# EasyEDA Pro project usbc_hub_schematic.epro

# Schematic Schematic2
Board Name: PCB2; Create Date: 2025-07-27; Page Name: P1; Project Name: usbchub; Schematic Name: Schematic2; Update Date: 2025-07-29; Company: EasyEDA.com; Page Size: A4; Version: V1.0
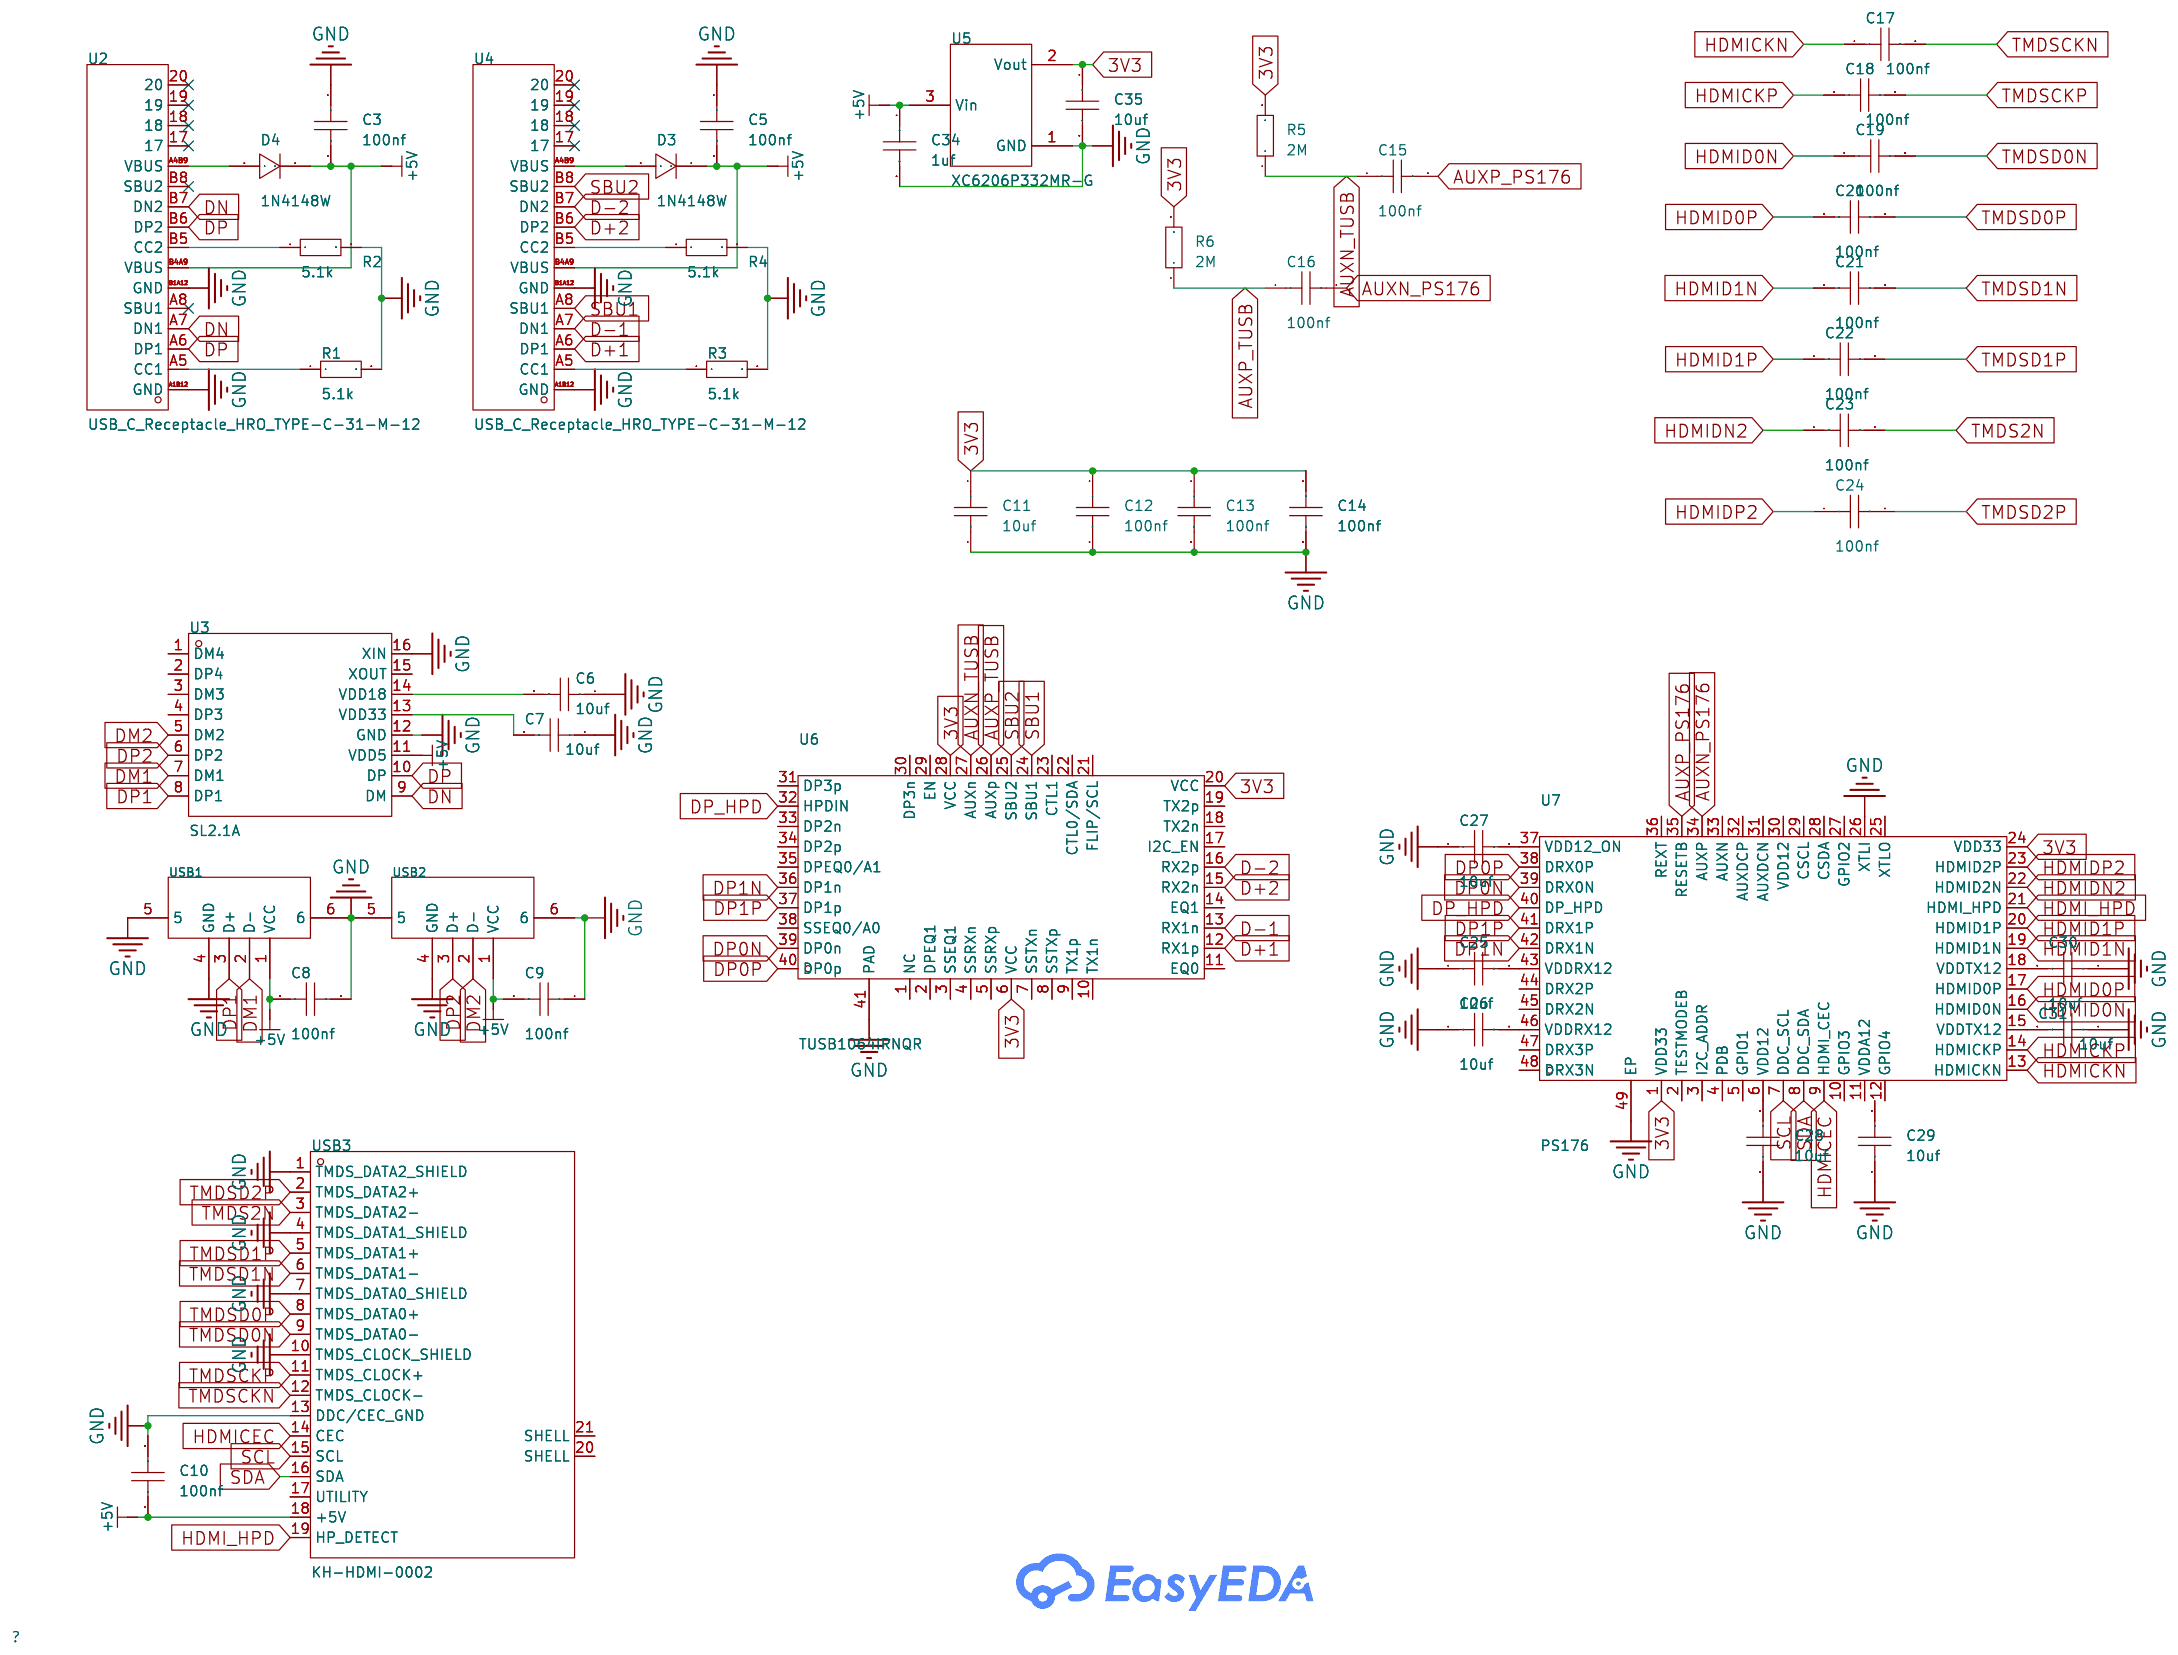
[diagram p0: schematic sheet]

## Parts
C3  100nf  [C0603]
C5  100nf  [C0603]
C6  10uf  [C0603]
C7  10uf  [C0603]
C8  100nf  [C0603]
C9  100nf  [C0603]
C10  100nf  [C0603]
C11  10uf  [C0603]
C12  100nf  [C0603]
C13  100nf  [C0603]
C14  100nf  [C0603]
C15  100nf  [C0603]
C16  100nf  [C0603]
C17  100nf  [C0603]
C18  100nf  [C0603]
C19  100nf  [C0603]
C20  100nf  [C0603]
C21  100nf  [C0603]
C22  100nf  [C0603]
C23  100nf  [C0603]
C24  100nf  [C0603]
C25  10uf  [C0603]
C26  10uf  [C0603]
C27  10uf  [C0603]
C28  10uf  [C0603]
C29  10uf  [C0603]
C30  10uf  [C0603]
C31  10uf  [C0603]
C34  1uf  [C0603]
C35  10uf  [C0603]
D3  1N4148W  [SOD-123F_L2.7-W1.6-LS3.8-RD]
D4  1N4148W  [SOD-123F_L2.7-W1.6-LS3.8-RD]
R1  5.1k  [R0603]
R2  5.1k  [R0603]
R3  5.1k  [R0603]
R4  5.1k  [R0603]
R5  2M  [R0603]
R6  2M  [R0603]
U2  USB_C_Receptacle_HRO_TYPE-C-31-M-12  [USB-SMD_TYPE-C16PIN-1]
U3  SL2.1A  [SOP-16_L10.0-W3.9-P1.27-LS6.0-BL]
U4  USB_C_Receptacle_HRO_TYPE-C-31-M-12  [USB-SMD_TYPE-C16PIN-1]
U5  XC6206P332MR-G  [SOT-23-3_L2.9-W1.6-P1.90-LS2.8-BR]
U6  TUSB1064IRNQR  [WQFN-40_L6.0-W4.0-P0.40-TL-EP4.7]
U7  PS176  [QFN-48_L6.0-W6.0-P0.40-TL-EP3.8]
USB1  903-131A1011D10100  [USB-A-TH_C46407]
USB2  903-131A1011D10100  [USB-A-TH_C46407]
USB3  KH-HDMI-0002  [HDMI-SMD_KH-HDMI-0002]

## Library data of the parts
C3 C5-C31 C34 C35 = CAP_0603: Supplier Footprint: 0603
D3 D4 = 1N4148W_C81598: Diode Configuration:Independent Type Forward Voltage (Vf@If):1V@50mA Reverse Voltage (Vr): Rectified Current: Reverse Leakage Current (Ir):1uA@75V Reverse Recovery Time (trr): Operating Temperature:- Operating Temperature:-; Supplier Part: C81598; Manufacturer: ST(先科); Supplier Footprint: SOD-123; Datasheet: https://atta.szlcsc.com/upload/public/pdf/source/20161024/1477288446905.pdf; Supplier: LCSC; Diode Configuration: Independent Type; Forward Voltage (Vf@If): 1V@50mA; Reverse Leakage Current (Ir): 1uA@75V
R1-R6 = Res_0603: Supplier Footprint: 0603
U2 U4 = USB_C_Receptacle_HRO_TYPE-C-31-M-12: Supplier Part: C9900015525; Supplier Footprint: USB_C_Receptacle_USB2.0; JLCPCB Part Class: Extended Part; Supplier: LCSC
U3 = SL2.1A: LCSC Part Name: USB2.0高速4端口HUB控制器; Supplier Part: C192893; Manufacturer: CoreChips(和芯润德); Supplier Footprint: SOP-16; JLCPCB Part Class: Extended Part; Datasheet: https://atta.szlcsc.com/upload/public/pdf/source/20180522/C192893_624110D24898D57AAC785E3DF98EA862.pdf; Supplier: LCSC
U5 = XC6206P332MR-G_C5446: Output Type: Maximum Input Voltage:6V Output Voltage:3.3V Output Voltage:3.3V MAX Output Current:200mA Power Supply Rejection Ratio (PSRR):- Dropout Voltage:680mV@(100mA) Output Polarity:Positive electrode Number of Outputs:1; LCSC Part Name: 输入6V 输出3.3V 200mA; Supplier Part: C5446; Manufacturer: TOREX(特瑞仕); Supplier Footprint: SOT-23-3L; JLCPCB Part Class: Basic Part; Datasheet: https://atta.szlcsc.com/upload/public/pdf/source/20130823/1457706639850.pdf; Supplier: LCSC; Maximum Input Voltage: 6V; Output Voltage: 3.3V; MAX Output Current: 200mA; Dropout Voltage: 680mV@(100mA); Output Polarity: Positive electrode; Number of Outputs: 1
U6 = TUSB1064IRNQR: Applications Function: Protocol:；DP 1.4 Number of Channels:4 Supply Voltage:3.3V Supply Voltage:3.3V Data Rate:10Gbps Operating Temperature:-40℃~+85℃ Operating Temperature:-40℃~+85℃; LCSC Part Name: TUSB1064 USB TYPE-C MDP交替模式10Gbps灌电流侧线性转接驱动器交叉点开关; Supplier Part: C2675165; Manufacturer: TI(德州仪器); Supplier Footprint: WQFN-40-EP(4x6); JLCPCB Part Class: Extended Part; Datasheet: https://www.ti.com/cn/lit/gpn/tusb1064; Supplier: LCSC; Protocol: ；DP 1.4; Number of Channels: 4; Supply Voltage: 3.3V; Data Rate: 10Gbps; Operating Temperature: -40℃~+85℃
U7 = PS176: Supplier Part: C209703; Manufacturer: parade(谱瑞科技); Supplier Footprint: QFN-48-EP(6x6); JLCPCB Part Class: Extended Part; Datasheet: https://atta.szlcsc.com/upload/public/pdf/source/20180530/C209703_54E1970A5C7B334E54DE40137D09E033.pdf; Supplier: LCSC
USB1 USB2 = 903-131A1011D10100: Connector Type:Type-A Standard:USB 2.0 Gender:Female Number of Ports:1 Number of Contacts:4P Current Rating - Power (Max):1.5A; LCSC Part Name: Type-A 母; Supplier Part: C46407; Manufacturer: 精拓金; Supplier Footprint: 插件; JLCPCB Part Class: Extended Part; Datasheet: https://atta.szlcsc.com/upload/public/pdf/source/20210301/C46407_0FDCFD777E72B2503A3E09AE32E4643C.pdf; Supplier: LCSC; Connector Type: Type-A; Standard: USB 2.0; Gender: Female; Number of Ports: 1; Number of Contacts: 4P; Current Rating - Power (Max): 1.5A
USB3 = KH-HDMI-0002: Connector Type:HDMI-C Gender:Mother Number of Pins:19P Mounting Style:Horizontal attachment Current Rating (Max):0.5A Rated Voltage (Max):40V Operating Temperature Range:-20℃~+85℃ Operating Temperature Range:-20℃~+85℃; Supplier Part: C5204136; Manufacturer: kinghelm(金航标); Supplier Footprint: SMD; JLCPCB Part Class: Extended Part; Datasheet: https://atta.szlcsc.com/upload/public/pdf/source/20221019/BF777A9BB0418986271236976E6968F4.pdf; Supplier: LCSC; Connector Type: HDMI-C; Gender: Mother; Number of Pins: 19P; Mounting Style: Horizontal attachment; Current Rating (Max): 0.5A; Rated Voltage (Max): 40V; Operating Temperature Range: -20℃~+85℃

## Nets
3V3: C11.1 C12.1 C13.1 C14.1 C35.1 R5.2 R6.2 U5.2(Vout) U6.6(VCC) U6.20(VCC) U6.28(VCC) U7.1(VDD33) U7.24(VDD33)
+5V: C3.2 C5.2 C8.2 C9.2 C10.1 C34.1 D3.1(K) D4.1(K) U2.B4A9(VBUS) U3.11(VDD5) U4.B4A9(VBUS) U5.3(Vin) USB1.1(VCC) USB2.1(VCC) USB3.18(+5V)
GND: C3.1 C5.1 C6.1 C7.1 C8.1 C9.1 C10.2 C11.2 C12.2 C13.2 C14.2 C25.1 C26.1 C27.1 C28.1 C29.1 C30.1 C31.1 C34.2 C35.2 R1.2 R2.2 R3.2 R4.2 U2.A1B12(GND) U2.B1A12(GND) U3.12(GND) U3.16(XIN) U4.A1B12(GND) U4.B1A12(GND) U5.1(GND) U6.41(PAD) U7.26(XTLI) U7.49(EP) USB1.4(GND) USB1.5 USB1.6 USB2.4(GND) USB2.5 USB2.6 USB3.1(TMDS_DATA2_SHIELD) USB3.4(TMDS_DATA1_SHIELD) USB3.7(TMDS_DATA0_SHIELD) USB3.10(TMDS_CLOCK_SHIELD) USB3.13(DDC/CEC_GND)
AUXN_PS176: C16.2 U7.34(AUXP)
AUXN_TUSB: C15.1 R5.1 U6.27(AUXn)
AUXP_PS176: C15.2 U7.35(RESETB)
AUXP_TUSB: C16.1 R6.1 U6.26(AUXp)
D+1: U4.A6(DP1) U6.12(RX1p)
D+2: U4.B6(DP2) U6.15(RX2n)
D-1: U4.A7(DN1) U6.13(RX1n)
D-2: U4.B7(DN2) U6.16(RX2p)
DM1: U3.7(DM1) USB1.2(D-)
DM2: U3.5(DM2) USB2.2(D-)
DN: U2.A7(DN1) U2.B7(DN2) U3.9(DM)
DP: U2.A6(DP1) U2.B6(DP2) U3.10(DP)
DP0N: U6.39(DP0n) U7.39(DRX0N)
DP0P: U6.40(DP0p) U7.38(DRX0P)
DP1: U3.8(DP1) USB1.3(D+)
DP1N: U6.36(DP1n) U7.42(DRX1N)
DP1P: U6.37(DP1p) U7.41(DRX1P)
DP2: U3.6(DP2) USB2.3(D+)
DP_HPD: U6.32(HPDIN) U7.40(DP_HPD)
HDMI_HPD: U7.21(HDMI_HPD) USB3.19(HP_DETECT)
HDMICEC: U7.9(HDMI_CEC) USB3.14(CEC)
HDMICKN: C17.1 U7.13(HDMICKN)
HDMICKP: C18.1 U7.14(HDMICKP)
HDMID0N: C19.1 U7.16(HDMID0N)
HDMID0P: C20.1 U7.17(HDMID0P)
HDMID1N: C21.1 U7.19(HDMID1N)
HDMID1P: C22.1 U7.20(HDMID1P)
HDMIDN2: C23.1 U7.22(HDMID2N)
HDMIDP2: C24.1 U7.23(HDMID2P)
SBU1: U4.A8(SBU1) U6.24(SBU1)
SBU2: U4.B8(SBU2) U6.25(SBU2)
SCL: U7.7(DDC_SCL) USB3.15(SCL)
SDA: U7.8(DDC_SDA) USB3.16(SDA)
TMDS2N: C23.2 USB3.3(TMDS_DATA2-)
TMDSCKN: C17.2 USB3.12(TMDS_CLOCK-)
TMDSCKP: C18.2 USB3.11(TMDS_CLOCK+)
TMDSD0N: C19.2 USB3.9(TMDS_DATA0-)
TMDSD0P: C20.2 USB3.8(TMDS_DATA0+)
TMDSD1N: C21.2 USB3.6(TMDS_DATA1-)
TMDSD1P: C22.2 USB3.5(TMDS_DATA1+)
TMDSD2P: C24.2 USB3.2(TMDS_DATA2+)
Net-(C6-2): C6.2 U3.14(VDD18)
Net-(C7-2): C7.2 U3.13(VDD33)
Net-(C25-2): C25.2 U7.43(VDDRX12)
Net-(C26-2): C26.2 U7.46(VDDRX12)
Net-(C27-2): C27.2 U7.37(VDD12_ON)
Net-(C28-2): C28.2 U7.6(VDD12)
Net-(C30-2): C30.2 U7.18(VDDTX12)
Net-(C31-2): C31.2 U7.15(VDDTX12)
Net-(D3-2): D3.2(A) U4.A4B9(VBUS)
Net-(D4-2): D4.2(A) U2.A4B9(VBUS)
Net-(R1-1): R1.1 U2.A5(CC1)
Net-(R2-1): R2.1 U2.B5(CC2)
Net-(R3-1): R3.1 U4.A5(CC1)
Net-(R4-1): R4.1 U4.B5(CC2)

Not connected (* = marked no-connect by the designer): C29 2; U2 17* 18* 19* 20* A8(SBU1)* B8(SBU2)*; U3 1(DM4) 2(DP4) 3(DM3) 4(DP3) 15(XOUT); U4 17* 18* 19* 20*; U6 1(NC) 2(DPEQ1) 3(SSEQ1) 4(SSRXn) 5(SSRXp) 7(SSTXn) 8(SSTXp) 9(TX1p) 10(TX1n) 11(EQ0) 14(EQ1) 17(I2C_EN) 18(TX2n) 19(TX2p) 21(FLIP/SCL) 22(CTL0/SDA) 23(CTL1) 29(EN) 30(DP3n) 31(DP3p) 33(DP2n) 34(DP2p) 35(DPEQ0/A1) 38(SSEQ0/A0); U7 2(TESTMODEB) 3(I2C_ADDR) 4(PDB) 5(GPIO1) 10(GPIO3) 11(VDDA12) 12(GPIO4) 25(XTLO) 27(GPIO2) 28(CSDA) 29(CSCL) 30(VDD12) 31(AUXDCN) 32(AUXDCP) 33(AUXN) 36(REXT) 44(DRX2P) 45(DRX2N) 47(DRX3P) 48(DRX3N); USB3 17(UTILITY) 20(SHELL) 21(SHELL)
